# EAGLE design racket_LED (EAGLE 8.4.1)
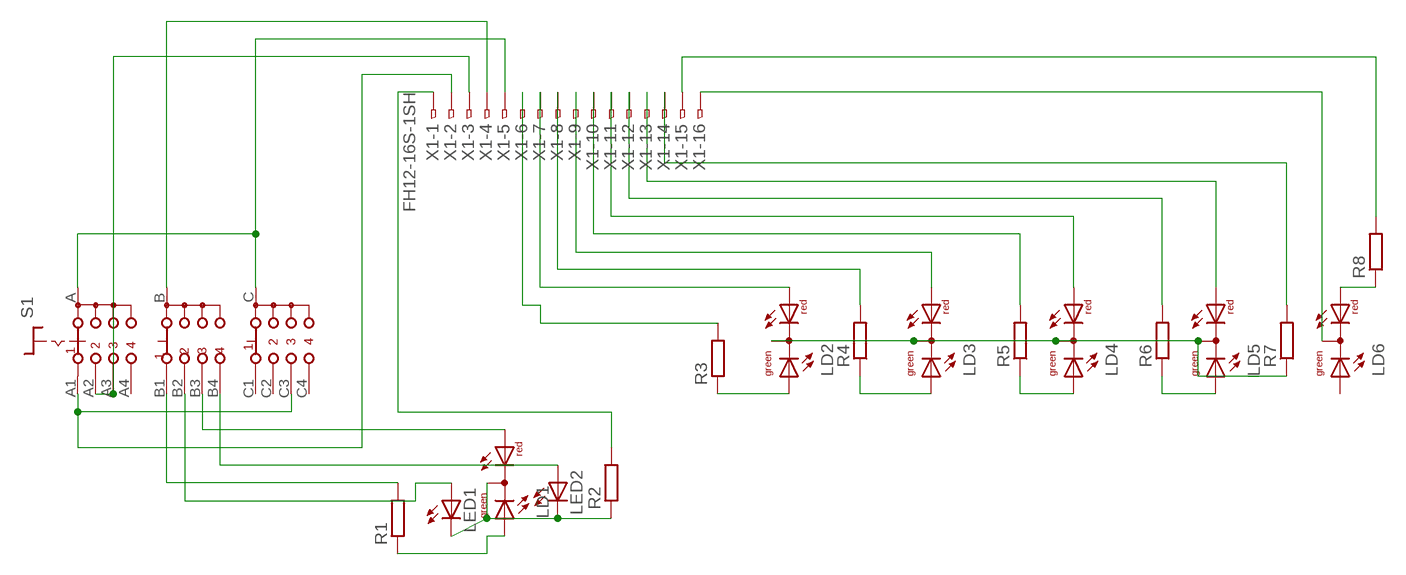
[diagram p0: schematic, sheet 1]

## Parts
LD1  DUOLED-RG-C  [DUOLED-C-5MM]
LD2  DUOLED-RG-C  [DUOLED-C-5MM]
LD3  DUOLED-RG-C  [DUOLED-C-5MM]
LD4  DUOLED-RG-C  [DUOLED-C-5MM]
LD5  DUOLED-RG-C  [DUOLED-C-5MM]
LD6  DUOLED-RG-C  [DUOLED-C-5MM]
LED1  LED3MM  [LED3MM]
LED2  LED3MM  [LED3MM]
R1  R-EU_M1206  [M1206]
R2  R-EU_M1206  [M1206]
R3  R-EU_M1206  [M1206]
R4  R-EU_M1206  [M1206]
R5  R-EU_M1206  [M1206]
R6  R-EU_M1206  [M1206]
R7  R-EU_M1206  [M1206]
R8  R-EU_M1206  [M1206]
S1  CK103X04  [CK103X04]
X1  FH12-16S-1SH  [FH12-16S-1SH]

## Nets
N$1: S1.B X1.4
N$2: S1.A1 S1.C3 X1.2
N$3: S1.A S1.C X1.5
N$4: R1.2 S1.B1
N$5: LD1.AX(AG) R1.1
N$6: LD1.C LED1.K(C) LED2.K(C) R2.1
N$7: R2.2 X1.1
N$8: LED2.A S1.B4
N$9: LD1.AR S1.B3
N$10: LED1.A S1.B2
N$11: S1.A2 S1.A3 X1.3
N$12: LD2.AX(AG) R3.1
N$13: R3.2 X1.6
N$14: LD2.AR X1.7
N$15: LD3.AX(AG) R4.1
N$16: LD4.AX(AG) R5.1
N$17: R4.2 X1.8
N$18: LD3.AR X1.9
N$19: R5.2 X1.10
N$20: LD4.AR X1.11
N$21: LD5.AX(AG) R6.1
N$22: R6.2 X1.12
N$23: LD5.AR X1.13
N$24: LD2.C LD3.C LD4.C LD5.C R7.1
N$25: R7.2 X1.14
N$26: LD6.C X1.16
N$27: R8.2 X1.15
N$28: LD6.AR R8.1
Unconnected: LD6.AX(AG) S1.A4 S1.C1 S1.C2 S1.C4

## Library data of the parts
LD1-LD6 = led:DUOLED-RG-C: DUO LED 2 colors (red/green), 5 mm, round, common Cathode www.ligitek.com or other producers.
LED1 LED2 = led:LED: LED OSRAM: - CHIPLED LG R971, LG N971, LY N971, LG Q971, LY Q971, LO R971, LY R971 LH N974, LH R974 LS Q976, LO Q976, LY Q976 LO Q996 - Hyper CHIPLED LW Q18S LB Q993, LB Q99A, LB R99A - SideLED LS A670, LO A670, LY A670, LG A670, LP A670 LB A673, LV A673, LT A673, LW A673 LH A674 LY A675 LS A676, LA A676, LO A676, LY A676, LW A676 LS A679, LY A679, LG A679 - Hyper Micro SIDELED® LS Y876, LA Y876, LO Y876, LY Y876 LT Y87S - SmartLED LW L88C, LW L88S LB L89C, LB L89S, LG L890 LS L89K, LO L89K, LY L89K LS L896, LA L896, LO L896, LY L896 - TOPLED LS T670, LO T670, LY T670, LG T670, LP T670 LSG T670, LSP T670, LSY T670, LOP T670, LYG T670 LG T671, LOG T671, LSG T671 LB T673, LV T673, LT T673, LW T673 LH T674 LS T676, LA T676, LO T676, LY T676, LB T676, LH T676, LSB T676, LW T676 LB T67C, LV T67C, LT T67C, LS T67K, LO T67K, LY T67K, LW E67C LS E67B, LA E67B, LO E67B, LY E67B, LB E67C, LV E67C, LT E67C LW T67C LS T679, LY T679, LG T679 LS T770, LO T770, LY T770, LG T770, LP T770 LB T773, LV T773, LT T773, LW T773 LH T774 LS E675, LA E675, LY E675, LS T675 LS T776, LA T776, LO T776, LY T776, LB T776 LHGB T686 LT T68C, LB T68C - Hyper Mini TOPLED® LB M676 - Mini TOPLED Santana® LG M470 LS M47K, LO M47K, LY M47K Source: http://www.osram.convergy.de LUXEON: - LUMILED® LXK2-PW12-R00, LXK2-PW12-S00, LXK2-PW14-U00, LXK2-PW14-V00 LXK2-PM12-R00, LXK2-PM12-S00, LXK2-PM14-U00 LXK2-PE12-Q00, LXK2-PE12-R00, LXK2-PE12-S00, LXK2-PE14-T00, LXK2-PE14-U00 LXK2-PB12-K00, LXK2-PB12-L00, LXK2-PB12-M00, LXK2-PB14-N00, LXK2-PB14-P00, LXK2-PB14-Q00 LXK2-PR12-L00, LXK2-PR12-M00, LXK2-PR14-Q00, LXK2-PR14-R00 LXK2-PD12-Q00, LXK2-PD12-R00, LXK2-PD12-S00 LXK2-PH12-R00, LXK2-PH12-S00 LXK2-PL12-P00, LXK2-PL12-Q00, LXK2-PL12-R00 Source: www.luxeon.com KINGBRIGHT: KA-3528ASYC Source: www.kingbright.com
R1-R8 = Vwvwbg:R-EU_: RESISTOR, European symbol
S1 = switch:CK103X04: ROTARY SWITCH C&K
X1 = con-hirose:FH12-16S-1S: 1mm Pitch Connectors For FPC/FFC Source: Data sheet <http://www.hirose.co.jp/cataloge_hp/e58605370.pdf>; OC_FARNELL: unknown; OC_NEWARK: unknown

## Board
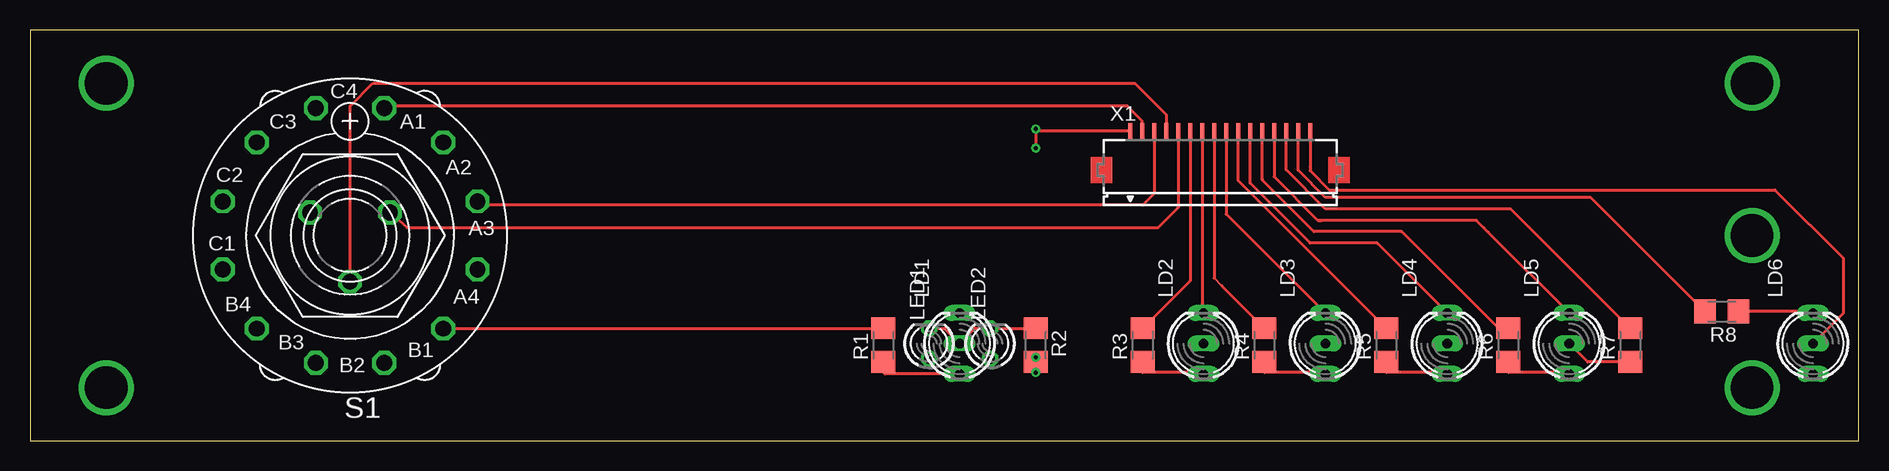
[diagram p1: board, top side]
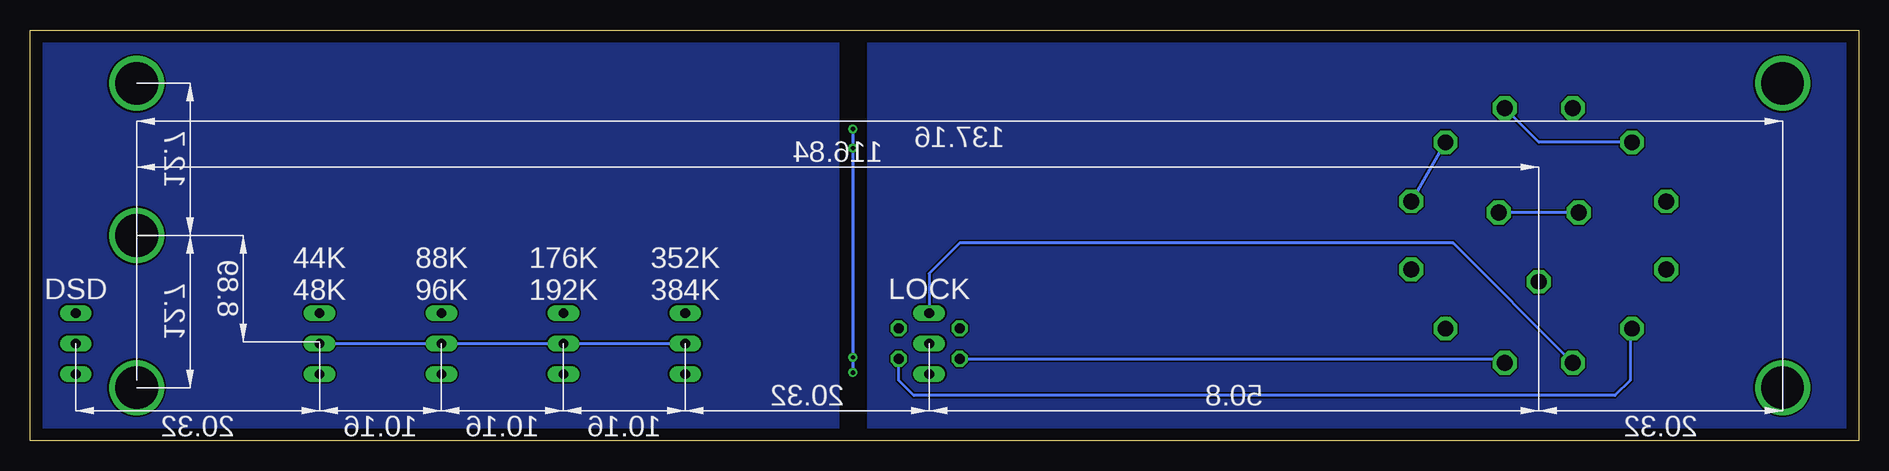
[diagram p2: board, bottom side, seen from below]

Size 152.4 x 34.29 mm. Coordinates in mm from the lower left corner, seen from the top.
Outline: 0,0 152.4,0 152.4,34.29 0,34.29 0,0
Copper layers (1*16): Top 0.035mm / dielectric 1.5mm / Bottom 0.035mm
Design rules "default *": minimum track width 6mil, minimum drill 0.35mm, track to track 6mil, track to pad 6mil, pad to pad 6mil, via to via 6mil, smd to smd 6mil, copper to edge 40mil, drill to drill 6mil, minimum pad ring 10mil, minimum via ring 8mil, stop-mask expansion 4mil, vias tented up to drill 30mil, thermal gap 10mil

### Footprints (pad centres in the part's own frame; a part is rotated, then mirrored left to right if it is on the bottom)
DUOLED-C-5MM = drill 0.813 long: AR 2.54,0; AX -2.54,0; C 0,0
LED3MM = drill 0.813 octagon: A -1.27,0; K 1.27,0
M1206 = smd 1.803 x 2: 1 -1.4,0; 2 1.4,0
CK103X04 = drill 1.321 octagon: A -3.334,-1.925; A1 -2.845,-10.617; A2 -7.772,-7.772; A3 -10.617,-2.845; A4 -10.617,2.845; B 0,3.85; B1 -7.772,7.772; B2 -2.845,10.617; B3 2.845,10.617; B4 7.772,7.772; C 3.334,-1.925; C1 10.617,2.845; C2 10.617,-2.845; C3 7.772,-7.772; C4 2.845,-10.617
FH12-16S-1SH = smd 0.3 x 1.3: 1 -7.5,3.25; 2 -6.5,3.25; 3 -5.5,3.25; 4 -4.5,3.25; 5 -3.5,3.25; 6 -2.5,3.25; 7 -1.5,3.25; 8 -0.5,3.25; 9 0.5,3.25; 10 1.5,3.25; 11 2.5,3.25; 12 3.5,3.25; 13 4.5,3.25; 14 5.5,3.25; 15 6.5,3.25; 16 7.5,3.25

### Placement (x,y rotation side)
LD1  77.47,8.13 90 top
LD2  97.79,8.13 90 top
LD3  107.95,8.13 90 top
LD4  118.11,8.13 90 top
LD5  128.27,8.13 90 top
LD6  148.59,8.13 90 top
LED1  74.93,8.13 90 top
LED2  80.01,8.13 90 top
R1  71.12,8 90 top
R2  83.82,8 270 top
R3  92.71,8 90 top
R4  102.87,8 90 top
R5  113.03,8 90 top
R6  123.19,8 90 top
R7  133.35,8 90 top
R8  140.97,10.79 180 top
S1  26.67,17.14 180 top
X1  99.19,22.61 0 top

### Tracks (layer width: path | path; a pad name or v marks a point on that pad's centre or on a via)
N$1
  Top 0.254: S1.B 26.67,27.94 28.57,29.84 92.08,29.84 94.69,27.23 X1.4
N$2
  Top 0.254: X1.2 92.69,26.69 91.44,27.94 29.69,27.94 S1.A1
  Bottom 0.254: S1.C3 26.67,24.92 S1.A1
N$3
  Top 0.254: S1.A 31.43,17.8 31.75,17.78 93.98,17.78 95.69,19.49 X1.5
  Bottom 0.254: S1.C S1.A
N$4
  Top 0.254: S1.B1 34.47,9.4 R1.2
N$5
  Top 0.254: LD1.AX 71.25,5.59 71.12,5.71 R1.1
N$6
  Top 0.254: LED1.K 76.2,9.4 LD1.C 78.74,9.4 LED2.K R2.1
N$7  (via drill 0.35)
  Top 0.254: X1.1 84,25.86 v83.82,26.04 v83.82,24.45 | v83.82,5.71 R2.2
  Bottom 0.254: v83.82,26.04 v83.82,24.45 v83.82,6.99 v83.82,5.71
N$8
  Bottom 0.254: S1.B4 19.05,9.22 19.05,5.08 20.32,3.81 78.74,3.81 80.01,5.08 LED2.A
N$9
  Bottom 0.254: S1.B3 33.81,16.51 74.93,16.51 77.47,13.97 LD1.AR
N$10
  Bottom 0.254: LED1.A 29.84,6.86 S1.B2
N$11
  Top 0.254: 37.59,19.68 S1.A3 37.59,19.68 | X1.3 93.69,20.66 92.71,19.68 37.59,19.68
  Bottom 0.254: S1.A2 S1.A3
N$12
  Top 0.254: LD2.AX 97.66,5.71 92.71,5.71 R3.1
N$13
  Top 0.254: R3.2 92.73,9.4 96.69,13.36 X1.6
N$14
  Top 0.2: 97.69,10.77 LD2.AR
  Top 0.254: X1.7 97.69,10.77
N$15
  Top 0.254: LD3.AX 107.57,5.71 102.87,5.71 R4.1
N$16
  Top 0.254: LD4.AX 117.98,5.71 113.03,5.71 R5.1
N$17
  Top 0.2: 98.69,13.58 99.32,12.96
  Top 0.254: 99.32,12.96 R4.2 | X1.8 98.69,13.58
N$18
  Top 0.254: X1.9 99.69,18.93 LD3.AR
N$19
  Top 0.254: R5.2 100.69,21.74 X1.10
N$20
  Top 0.254: LD4.AR 112.27,16.51 106.68,16.51 101.69,21.5 X1.11
N$21
  Top 0.254: LD5.AX 128.14,5.71 123.19,5.71 R6.1
N$22
  Top 0.254: 102.69,21.91 X1.12 | 102.69,21.91 102.69,21.77 | R6.2 122.75,9.4 122.56,9.21 114.3,17.46 107,17.46 102.69,21.77 | 102.69,21.77 102.69,21.91
N$23
  Top 0.254: 121.16,17.78 121.54,17.4 | 121.54,17.4 LD5.AR | X1.13 103.69,22.04 107.31,18.41 | 107.31,18.41 107.63,18.41 | 121.54,17.4 120.52,18.41 107.31,18.41
N$24
  Top 0.254: R7.1 129.8,6.6 LD5.C
  Bottom 0.254: LD5.C LD4.C LD3.C LD2.C
N$25
  Top 0.254: X1.14 104.69,22.63 107.95,19.37 123.38,19.37 R7.2
N$26
  Top 0.254: LD6.C 151.13,10.67 151.13,15.24 145.41,20.95 108.27,20.95 106.68,22.54 106.68,22.86 106.69,22.87 X1.16
N$27
  Top 0.254: R8.2 130.04,20.32 107.95,20.32 105.69,22.58 X1.15
N$28
  Top 0.254: LD6.AR 148.46,10.79 R8.1
N$29  (via drill 3.56 pad 0.6)
  other vias: 6.35,29.84
N$30  (via drill 3.56 pad 0.6)
  other vias: 143.51,17.14
N$31  (via drill 3.56 pad 0.6)
  other vias: 143.51,29.84
N$32  (via drill 3.56 pad 0.6)
  other vias: 143.51,4.45
N$33  (via drill 3.56 pad 0.6)
  other vias: 6.35,4.45
N$34
  pour Bottom: 152.4,34.29 85.09,34.29 85.09,0 152.4,0
N$35
  pour Bottom: 82.55,33.02 82.55,0 0,0 0,34.29 82.55,34.29

### Text on the board
bPlace: 352K / 384K | 176K / 192K | 88K / 96K | 44K / 48K | LOCK | DSD